# Altium project CAPTIVATE-ISO.PrjPcb
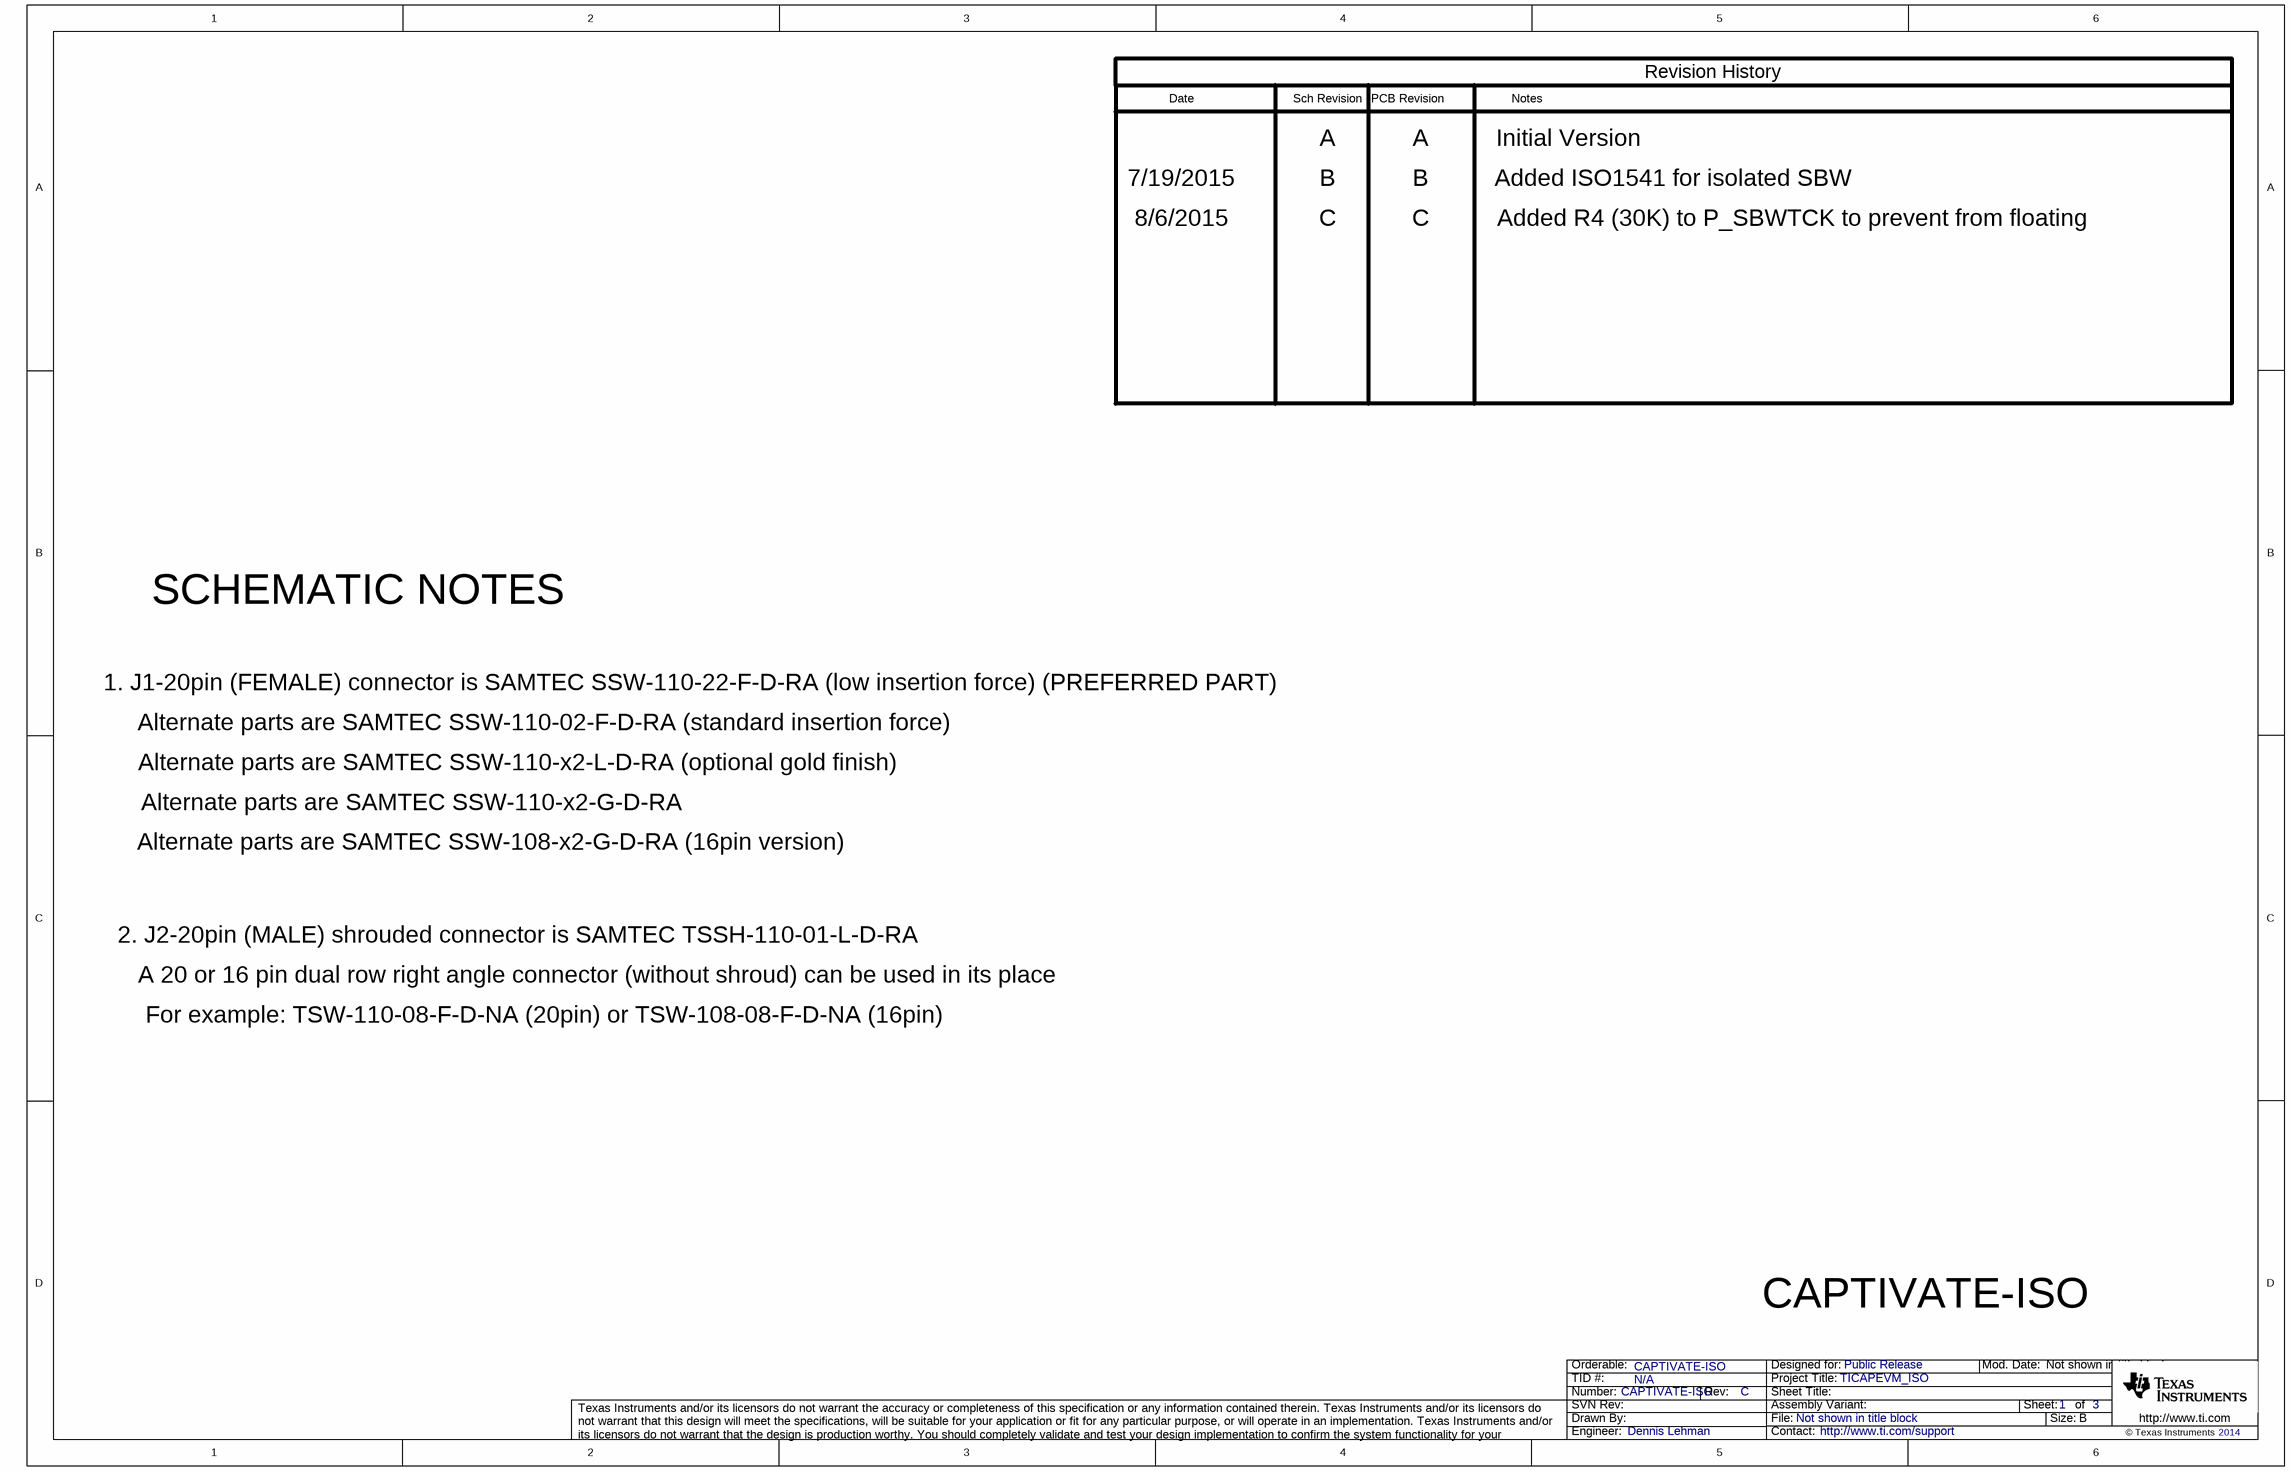
[diagram p0: CoverSheet.SchDoc]
CopyrightYear: 2014; EVM_orderable: CAPTIVATE-ISO; PCB_Layout: Dennis Lehman; PCB_Rev: C; PRJ_Customer: Public Release; PRJ_Engineer: Dennis Lehman; PRJ_Number: CAPTIVATE-ISO; PRJ_Title: TICAPEVM_ISO; SCH_Rev: C; TechSupport: http://www.ti.com/support; TID: N/A
3 sheets, 21 parts. Net scope: global (net labels, ports and power ports of the same name join across sheets).
Board file: captivate_iso.PcbDoc
Sheets:
  CoverSheet.SchDoc
  captivate_iso.SchDoc
  hardware.SchDoc

## Sheet CoverSheet.SchDoc
size 431 x 279 mm; Date: Not shown in title block; ApprovedBy: Not shown in title block; CheckedBy: Not shown in title block; Author: Not shown in title block; CompanyName: Not shown in title block; Engineer: Not shown in title block; Organization: Not shown in title block; Address1: Not shown in title block; Address2: Not shown in title block; Address3: Not shown in title block; Address4: Not shown in title block; DocumentNumber: 1; Revision: Use project parameter SCH_Rev; SheetNumber: 1; SheetTotal: 3; PageSetup: Record=PageOptions|CenterHorizontal=True|CenterVertical=True|PrintScale=1.00|XCorrection=1.00|YCorrection=1.00|PrintKind=0|BorderSize=5000000|LeftOffset=0|BottomOffset=0|Orientation=2|PaperLength=1000|PaperWidth=1000|Scale=100|PaperSource=15|PrintQuality=600|MediaType=1|DitherType=10|PaperKind=Letter|PrintScaleMode=1; CurrentTime: Not shown in title block; CurrentDate: Not shown in title block; Time: Not shown in title block; DocumentFullPathAndName: Not shown in title block; DocumentName: Not shown in title block; ModifiedDate: Not shown in title block; ImagePath: Not shown in title block

### Notes on the sheet
- Date
- Sch Revision
- PCB Revision
- Notes
- Revision History
- A
- Initial Version
- 7/19/2015
- 8/6/2015
- B
- C
- Added ISO1541 for isolated SBW
- Added R4 (30K) to P_SBWTCK to prevent from floating
- SCHEMATIC NOTES
- 1. J1-20pin (FEMALE) connector is SAMTEC SSW-110-22-F-D-RA (low insertion force) (PREFERRED PART)
- Alternate parts are SAMTEC SSW-110-x2-L-D-RA (optional gold finish)
- Alternate parts are SAMTEC SSW-110-02-F-D-RA (standard insertion force)
- Alternate parts are SAMTEC SSW-110-x2-G-D-RA
- Alternate parts are SAMTEC SSW-108-x2-G-D-RA (16pin version)
- 2. J2-20pin (MALE) shrouded connector is SAMTEC TSSH-110-01-L-D-RA
- For example: TSW-110-08-F-D-NA (20pin) or TSW-108-08-F-D-NA (16pin)
- A 20 or 16 pin dual row right angle connector (without shroud) can be used in its place
- CAPTIVATE-ISO
- Drawn By:
- SVN Rev:
- Number:
- TID #:
- Orderable:
- Rev:
- Sheet Title:
- File:
- Project Title:
- Designed for:
- Assembly Variant:
- Mod. Date:
- Sheet:
- Size:
- of
- http://www.ti.com
- Texas Instruments and/or its licensors do not warrant the accuracy or completeness of this specification or any information contained therein. Texas Instruments and/or its licensors do not warrant that this design will meet the specifications, will be suitable for your application or fit for any particular purpose, or will operate in an implementation. Texas Instruments and/or its licensors do not warrant that the design is production worthy. You should completely validate and test your design implementation to confirm the system functionality for your application.
- Engineer:
- Contact:
- © Texas Instruments

## Sheet captivate_iso.SchDoc
size 431 x 279 mm; Date: Not shown in title block; ApprovedBy: Not shown in title block; CheckedBy: Not shown in title block; Author: Not shown in title block; CompanyName: Not shown in title block; Engineer: Not shown in title block; Organization: Not shown in title block; Address1: Not shown in title block; Address2: Not shown in title block; Address3: Not shown in title block; Address4: Not shown in title block; DocumentNumber: 1; Revision: Use project parameter SCH_Rev; SheetNumber: 2; SheetTotal: 3; PageSetup: Record=PageOptions|CenterHorizontal=True|CenterVertical=True|PrintScale=1.00|XCorrection=1.00|YCorrection=1.00|PrintKind=0|BorderSize=5000000|LeftOffset=0|BottomOffset=0|Orientation=2|PaperLength=1000|PaperWidth=1000|Scale=100|PaperSource=15|PrintQuality=600|MediaType=1|DitherType=10|PaperKind=Letter|PrintScaleMode=1; CurrentTime: Not shown in title block; CurrentDate: Not shown in title block; Time: Not shown in title block; DocumentFullPathAndName: Not shown in title block; DocumentName: Not shown in title block; ModifiedDate: Not shown in title block; ImagePath: Not shown in title block
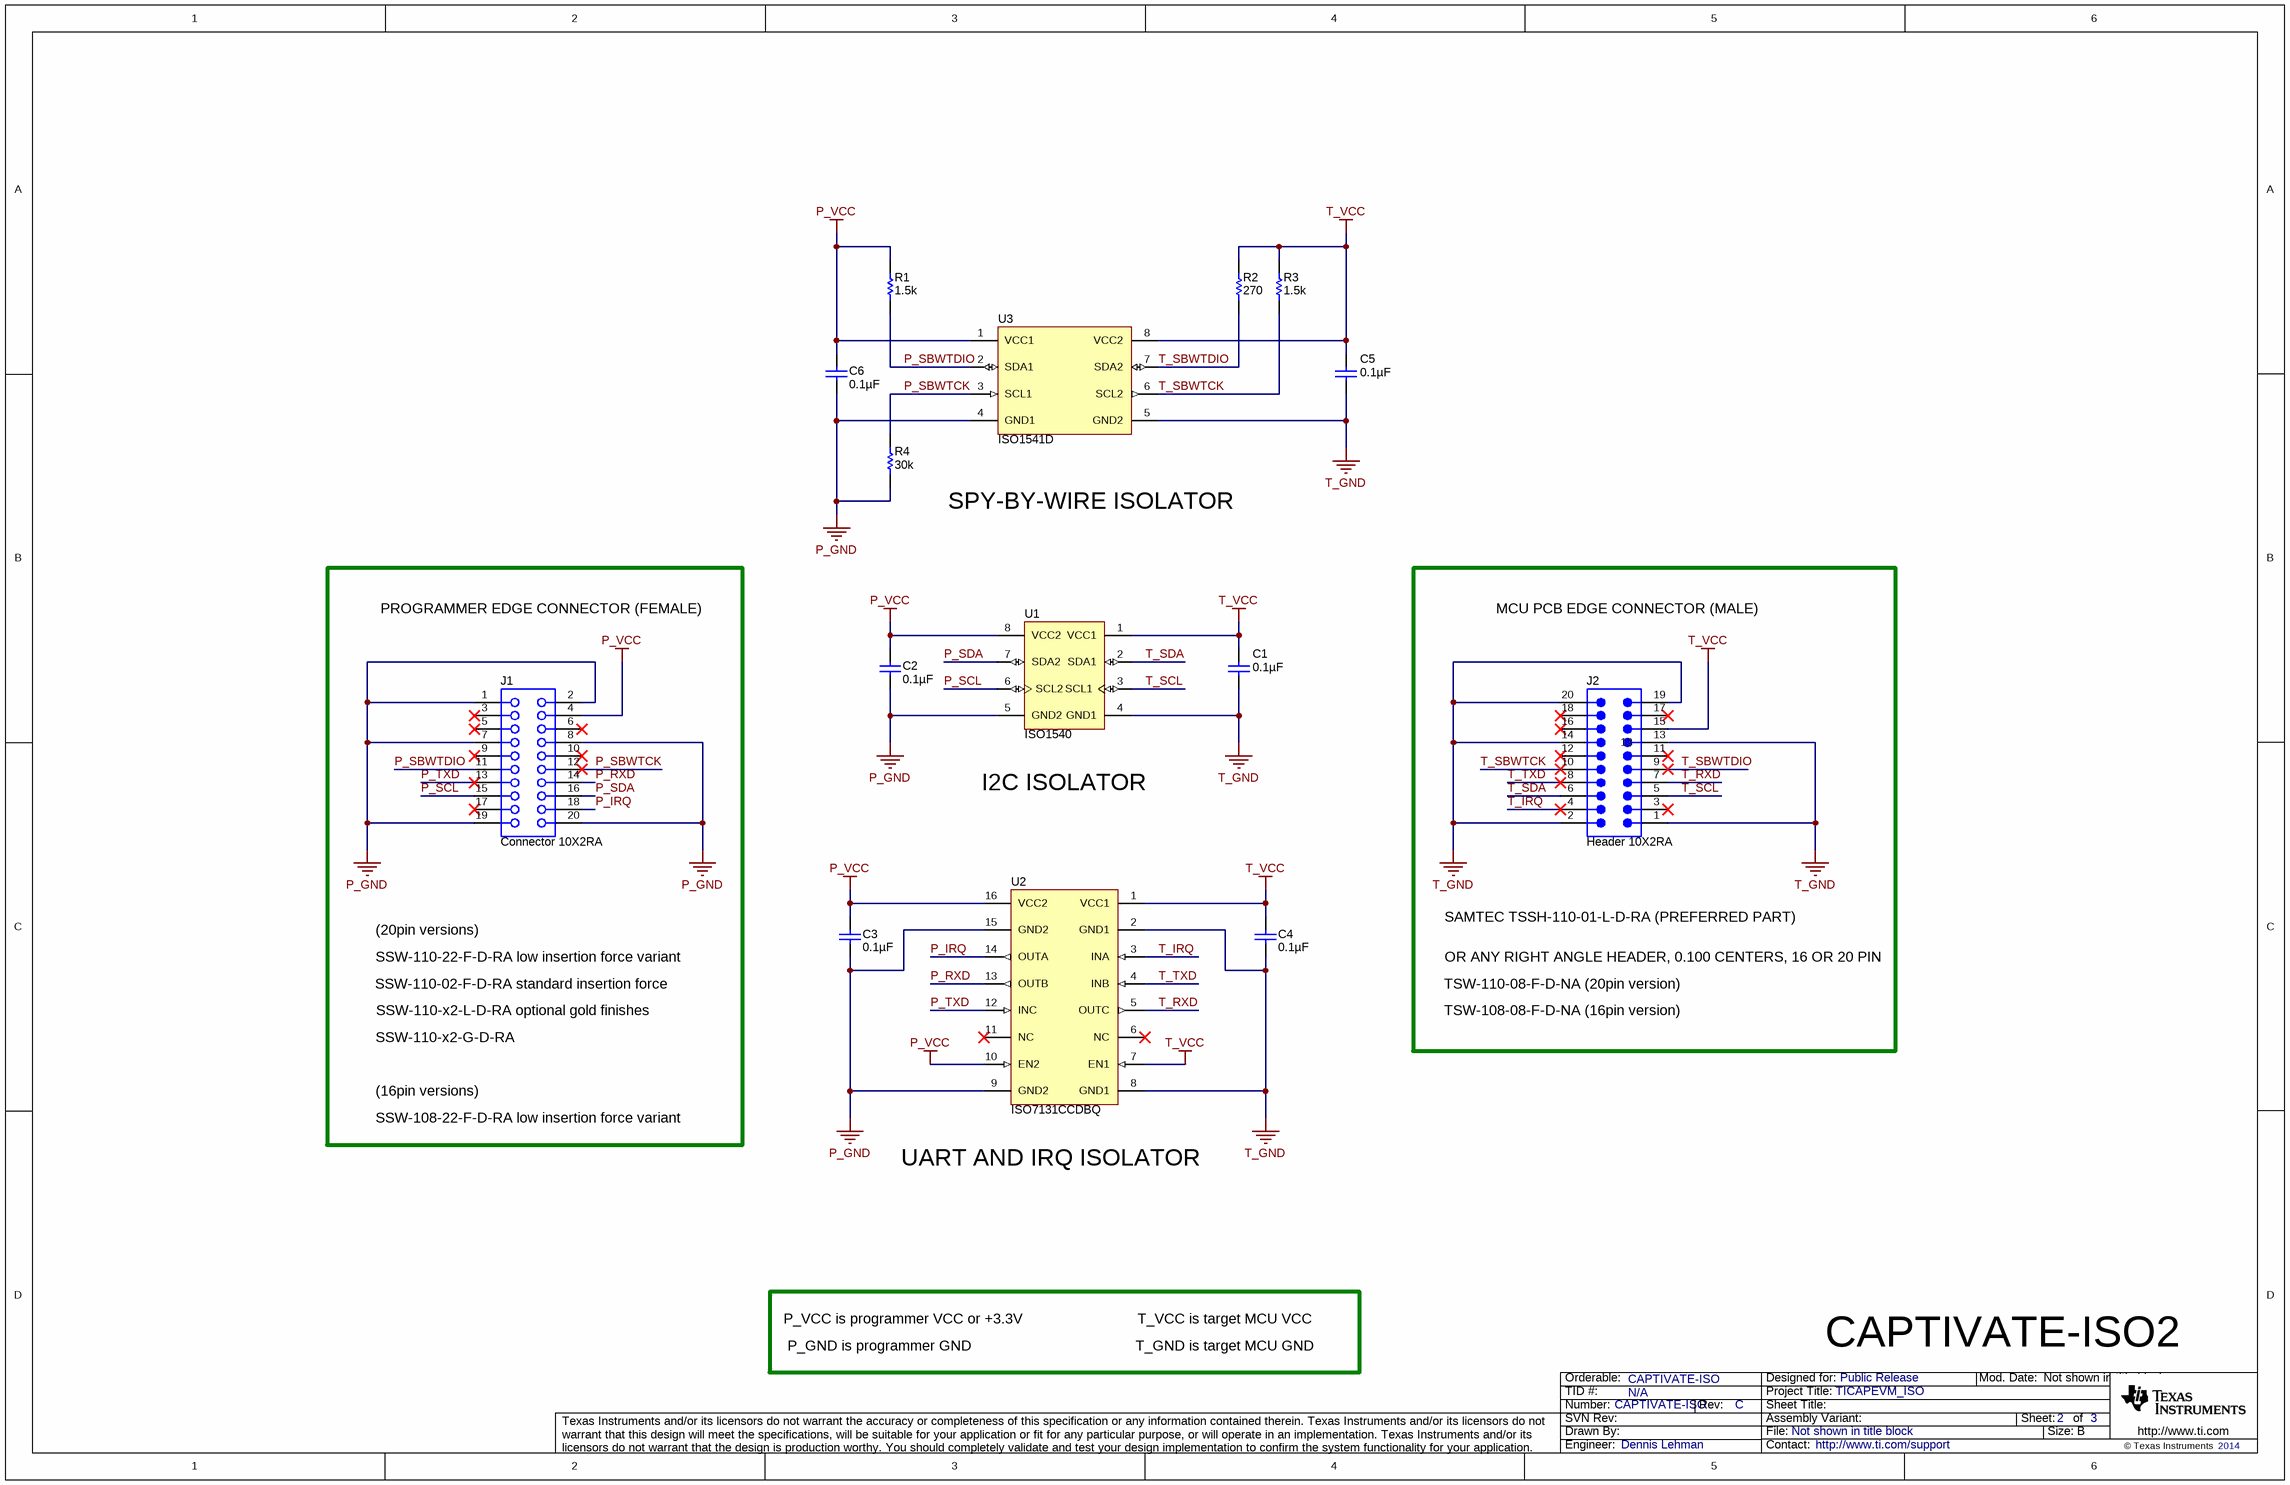
[diagram p1: captivate_iso.SchDoc]

### Parts
C1  ValueDisplayed: 0.1µF  [0402]  (hidden comment: C1005X5R1A104K)
C2  ValueDisplayed: 0.1µF  [0402]  (hidden comment: C1005X5R1A104K)
C3  ValueDisplayed: 0.1µF  [0402]  (hidden comment: C1005X5R1A104K)
C4  ValueDisplayed: 0.1µF  [0402]  (hidden comment: C1005X5R1A104K)
C5  ValueDisplayed: 0.1µF  [0402]  (hidden comment: C1005X5R1A104K)
C6  ValueDisplayed: 0.1µF  [0402]  (hidden comment: C1005X5R1A104K)
J1  Connector 10X2RA  [CONN2X10RA]
J2  Header 10X2RA  [HDR2X10RA]
R1  ValueDisplayed: 1.5k  [0402]  (hidden comment: CRCW04021K50JNED)
R2  ValueDisplayed: 270  [0402]  (hidden comment: CRCW0402270RJNED)
R3  ValueDisplayed: 1.5k  [0402]  (hidden comment: CRCW04021K50JNED)
R4  ValueDisplayed: 30k  [0402]  (hidden comment: CRCW040230K0JNED)
U1  ISO1540  [D0008A_L]
U2  ISO7131CCDBQ  [DBQ0016A_N]
U3  ISO1541D  [D0008A_N]

### Nets
P_GND: C2.1 C3.1 C6.1 J1.1 J1.2 J1.7 J1.8 J1.19 J1.20 R4.1 U1.5(GND2) U2.9(GND2) U2.15(GND2) U3.4(GND1)
P_VCC: C2.2 C3.2 C6.2 J1.4 R1.2 U1.8(VCC2) U2.10(EN2) U2.16(VCC2) U3.1(VCC1)
T_GND: C1.2 C4.1 C5.2 J2.1 J2.2 J2.13 J2.14 J2.19 J2.20 U1.4(GND1) U2.2(GND1) U2.8(GND1) U3.5(GND2)
T_VCC: C1.1 C4.2 C5.1 J2.15 R2.2 R3.2 U1.1(VCC1) U2.1(VCC1) U2.7(EN1) U3.8(VCC2)
P_IRQ: J1.18 U2.14(OUTA)
P_RXD: J1.14 U2.13(OUTB)
P_SBWTCK: J1.12 R4.2 U3.3(SCL1)
P_SBWTDIO: J1.11 R1.1 U3.2(SDA1)
P_SCL: J1.15 U1.6(SCL2)
P_SDA: J1.16 U1.7(SDA2)
P_TXD: J1.13 U2.12(INC)
T_IRQ: J2.4 U2.3(INA)
T_RXD: J2.7 U2.5(OUTC)
T_SBWTCK: J2.10 R3.1 U3.6(SCL2)
T_SBWTDIO: J2.9 R2.1 U3.7(SDA2)
T_SCL: J2.5 U1.3(SCL1)
T_SDA: J2.6 U1.2(SDA1)
T_TXD: J2.8 U2.4(INB)

Not connected (* = marked no-connect by the designer): J1 3* 5* 6* 9* 10* 17*; J2 3* 11* 12* 16* 17* 18*; U2 6(NC)* 11(NC)*

### Notes on the sheet
- SPY-BY-WIRE ISOLATOR
- PROGRAMMER EDGE CONNECTOR (FEMALE)
- MCU PCB EDGE CONNECTOR (MALE)
- I2C ISOLATOR
- (20pin versions)
- SSW-110-22-F-D-RA low insertion force variant
- SAMTEC TSSH-110-01-L-D-RA (PREFERRED PART)
- OR ANY RIGHT ANGLE HEADER, 0.100 CENTERS, 16 OR 20 PIN
- SSW-110-x2-G-D-RA
- SSW-110-x2-L-D-RA optional gold finishes
- SSW-110-02-F-D-RA standard insertion force
- TSW-110-08-F-D-NA (20pin version)
- TSW-108-08-F-D-NA (16pin version)
- (16pin versions)
- SSW-108-22-F-D-RA low insertion force variant
- UART AND IRQ ISOLATOR
- P_GND is programmer GND
- P_VCC is programmer VCC or +3.3V
- T_VCC is target MCU VCC
- T_GND is target MCU GND
- CAPTIVATE-ISO2
- Drawn By:
- SVN Rev:
- Number:
- TID #:
- Orderable:
- Rev:
- Sheet Title:
- File:
- Project Title:
- Designed for:
- Assembly Variant:
- Mod. Date:
- Sheet:
- Size:
- of
- B
- http://www.ti.com
- Texas Instruments and/or its licensors do not warrant the accuracy or completeness of this specification or any information contained therein. Texas Instruments and/or its licensors do not warrant that this design will meet the specifications, will be suitable for your application or fit for any particular purpose, or will operate in an implementation. Texas Instruments and/or its licensors do not warrant that the design is production worthy. You should completely validate and test your design implementation to confirm the system functionality for your application.
- Engineer:
- Contact:
- © Texas Instruments

### Library data of the parts
C1-C6 = C1005X5R1A104K: CAP, CERM, 0.1 µF, 10 V, +/- 10%, X5R, 0402; Manufacturer: TDK; Polarized: N; CompType: Capacitor; Value: 0.1uF; U/M: EA; Cap_F: 0.0000001; Tolerance_%: 10; ESR_ohm: 0.0186; Value1: 0.0186 ohm; Value2: 10V; TaMin_C: -55; TaMax_C: 85; SymbolVersion: 2008-07-09; PartNumber: C1005X5R1A104K; PackageReference: 0402; RoHS: Y; VDC_V: 10; MountType: SMT; Technology: Ceramic; TempCo: X5R; Cap_Case: 0402; Published: 2008-06-19; Publisher: Texas Instruments; LatestRevisionDate: 2014-12-10; ComponentLink1Description: Datasheet link; ComponentLink1URL: http://www.tdk.co.jp/tefe02/e412_c.pdf; Supplier 1: Digi-Key; Supplier Part Number 1: 445-1265-1-ND; Supplier 2: Farnell; Supplier Part Number 2: 1844111
J1 = Connector 10X2RA: Connector, Female, 10-Pin, 2 row, Right Angle; Manufacturer: Samtec; PartNumber: SSW-110-22-F-D-RA; Alternate PartNumber: SSW-110-02-F-D-RA; LatestRevisionDate: 17-Jul-2002; LatestRevisionNote: Re-released for DXP Platform.; Publisher: Altium Limited
J2 = Header 10X2RA: Header, Male, 10-Pin, 2 row, Shround, Right Angle; Manufacturer: Samtec; PartNumber: TSSH-110-01-L-D-RA; LatestRevisionDate: 17-Jul-2002; LatestRevisionNote: Re-released for DXP Platform.; Publisher: Altium Limited; Supplier: Samtec
R1 R3 = CRCW04021K50JNED: RES, 1.5 k, 5%, 0.063 W, 0402; Manufacturer: Vishay-Dale; CompType: Resistor; Value: 1.5k; Res_ohm: 1500; Value_Code: 1k50; Tolerance_%: 5; Power_W: 0.063; Value2: 0.063W; VDC_V: 50; TempCo: 200 ppm/C; EIA_Code: E24; U/M: EA; SymbolVersion: 2009-05-29; PartNumber: CRCW04021K50JNED; PackageReference: 0402; RoHS: Y; Value1: 5%; MountType: SMT; Technology: Thick Film; Published: 2008-06-26; Publisher: Texas Instruments; LatestRevisionDate: 2015-05-08; ComponentLink1Description: Datasheet link; ComponentLink1URL: http://www.vishay.com/docs/20035/dcrcwe3.pdf; Supplier 1: Digi-Key; Supplier Part Number 1: 541-1.5KJCT-ND; Supplier 2: Mouser; Supplier Part Number 2: 71-CRCW0402J-1.5K-E3; Supplier 3: Farnell; Supplier Part Number 3: 1558782
R2 = CRCW0402270RJNED: RES, 270, 5%, 0.063 W, 0402; Manufacturer: Vishay-Dale; CompType: Resistor; Value: 270; Value_Code: 270R; Tolerance_%: 5; Power_W: 0.063; Value2: 0.063W; VDC_V: 50; TempCo: 200 ppm/C; EIA_Code: E24; U/M: EA; SymbolVersion: 2009-05-29; PartNumber: CRCW0402270RJNED; PackageReference: 0402; RoHS: Y; Res_ohm: 270; Value1: 5%; MountType: SMT; Technology: Thick Film; Published: 2008-06-26; Publisher: Texas Instruments; LatestRevisionDate: 2015-05-08; ComponentLink1Description: Datasheet link; ComponentLink1URL: http://www.vishay.com/docs/20035/dcrcwe3.pdf; Supplier 1: Digi-Key; Supplier Part Number 1: 541-270JCT-ND; Supplier 2: Mouser; Supplier Part Number 2: 71-CRCW0402J-270-E3; Supplier 3: Farnell; Supplier Part Number 3: 1514691
R4 = CRCW040230K0JNED: RES, 30 k, 5%, 0.063 W, 0402; Manufacturer: Vishay-Dale; CompType: Resistor; Value: 30k; Res_ohm: 30000; Value_Code: 30k0; Tolerance_%: 5; Power_W: 0.063; Value2: 0.063W; VDC_V: 50; TempCo: 200 ppm/C; EIA_Code: E24; U/M: EA; SymbolVersion: 2009-05-29; PartNumber: CRCW040230K0JNED; PackageReference: 0402; RoHS: Y; Value1: 5%; MountType: SMT; Technology: Thick Film; Published: 2008-06-26; Publisher: Texas Instruments; LatestRevisionDate: 2015-05-08; ComponentLink1Description: Datasheet link; ComponentLink1URL: http://www.vishay.com/docs/20035/dcrcwe3.pdf; Supplier 1: Digi-Key; Supplier Part Number 1: 541-30KJCT-ND; Supplier 2: Mouser; Supplier Part Number 2: 71-CRCW0402J-30K-E3; Supplier 3: Farnell; Supplier Part Number 3: 1514695
U1 = ISO1540: I2C Bidirectional Isolator, 2 Channel Width, 3.0 to 12.0 V, -40 to 85 degC, 8-pin SOIC (D), Green (RoHS & no Sb/Br); Manufacturer: Texas Instruments; Alternate Manufacturer: None; Alternate PartNumber: Equivalent; VCC(Max)(V): 12; VCC(Min)(V): 3; Max Frequency(kHz): 400; Channel Width: 2; 5V Tolerant I/O: Yes; DatasheetVersion: SCPS145A; PackageVersion: revM, Jun-2011; PackageReference: D0008A; PackageDescription: 8-Pin Plastic Small Outline Integrated Circuit, 4.9 x 3.9 mm, Pitch 1.27 mm Pitch; Supplier 1: Digi-Key; Supplier Part Number 1: 296-34896-5-ND; Eco-Plan: Green (RoHS & no Sb/Br); SubFamily: I2C Bidirectional Isolator; Vcc range(V): 3.0 to 12.0; Master Side I2C Bus Capacitance Supported(pF): 400; Slave Side I2C Bus Capacitance Supported(pF): 400; Open Drain I/O Type: Yes; MountType: SMT; PartNumber: ISO1540; Code_JEDEC: MS-012AA; ComponentLink1Description: Datasheet; ComponentLink1URL: http://www.ti.com/general/docs/lit/getliterature.tsp?genericPartNumber=P82B715&fileType=pdf; ComponentLink2Description: URL Link1; ComponentLink2URL: SamplesURL:http://www.ti.com/product/iso1540#samples
U2 = ISO7131CCDBQ: 4242-VPK Small-Footprint and Low-Power Triple Channels Digital Isolators, DBQ0016A; Manufacturer: Texas Instruments; SymbolCreator: a0799628; CompType: IC; U/M: EA; PackageReference: DBQ0016A; MountType: SMT; PartNumber: ISO7131CCDBQ; ComponentLink1Description: Datasheet Link; ComponentLink1URL: http://www.ti.com/lit/ds/symlink/iso7141cc.pdf; Alternate Manufacturer: Texas Instruments; SymbolVersion: 2013-09-25; RoHS: Y; Publisher: Texas Instruments; LatestRevisionDate: 2014-12-10; Supplier 1: Digikey; Supplier Part Number 1: 296-40134-2-ND
U3 = ISO1541D: Low-Power Bidirectional I2C Isolators, D0008A; Manufacturer: Texas Instruments; SymbolCreator: a0411947; CompType: IC; U/M: EA; SymbolVersion: 2013-04-30; PartNumber: ISO1541D; PackageReference: D0008A; MountType: SMT; ComponentLink1Description: Datasheet Link; ComponentLink1URL: http://www.ti.com/lit/ds/symlink/iso1541.pdf; RoHS: Y; Publisher: Texas Instruments; LatestRevisionDate: 2015-05-12; Alternate Manufacturer: Texas Instruments; Supplier 1: Digikey; Supplier Part Number 1: 296-34872-2-ND

## Sheet hardware.SchDoc
size 431 x 279 mm; Date: Not shown in title block; ApprovedBy: Not shown in title block; CheckedBy: Not shown in title block; Author: Not shown in title block; CompanyName: Not shown in title block; Engineer: Not shown in title block; Organization: Not shown in title block; Address1: Not shown in title block; Address2: Not shown in title block; Address3: Not shown in title block; Address4: Not shown in title block; DocumentNumber: 3; Revision: Use project parameter SCH_Rev; SheetNumber: 3; SheetTotal: 3; PageSetup: Record=PageOptions|CenterHorizontal=True|CenterVertical=True|PrintScale=1.00|XCorrection=1.00|YCorrection=1.00|PrintKind=0|BorderSize=5000000|LeftOffset=0|BottomOffset=0|Orientation=2|PaperLength=1000|PaperWidth=1000|Scale=100|PaperSource=15|PrintQuality=600|MediaType=1|DitherType=10|PaperKind=Letter|PrintScaleMode=1; CurrentTime: Not shown in title block; CurrentDate: Not shown in title block; Time: Not shown in title block; DocumentFullPathAndName: Not shown in title block; DocumentName: Not shown in title block; ModifiedDate: Not shown in title block; ImagePath: Not shown in title block
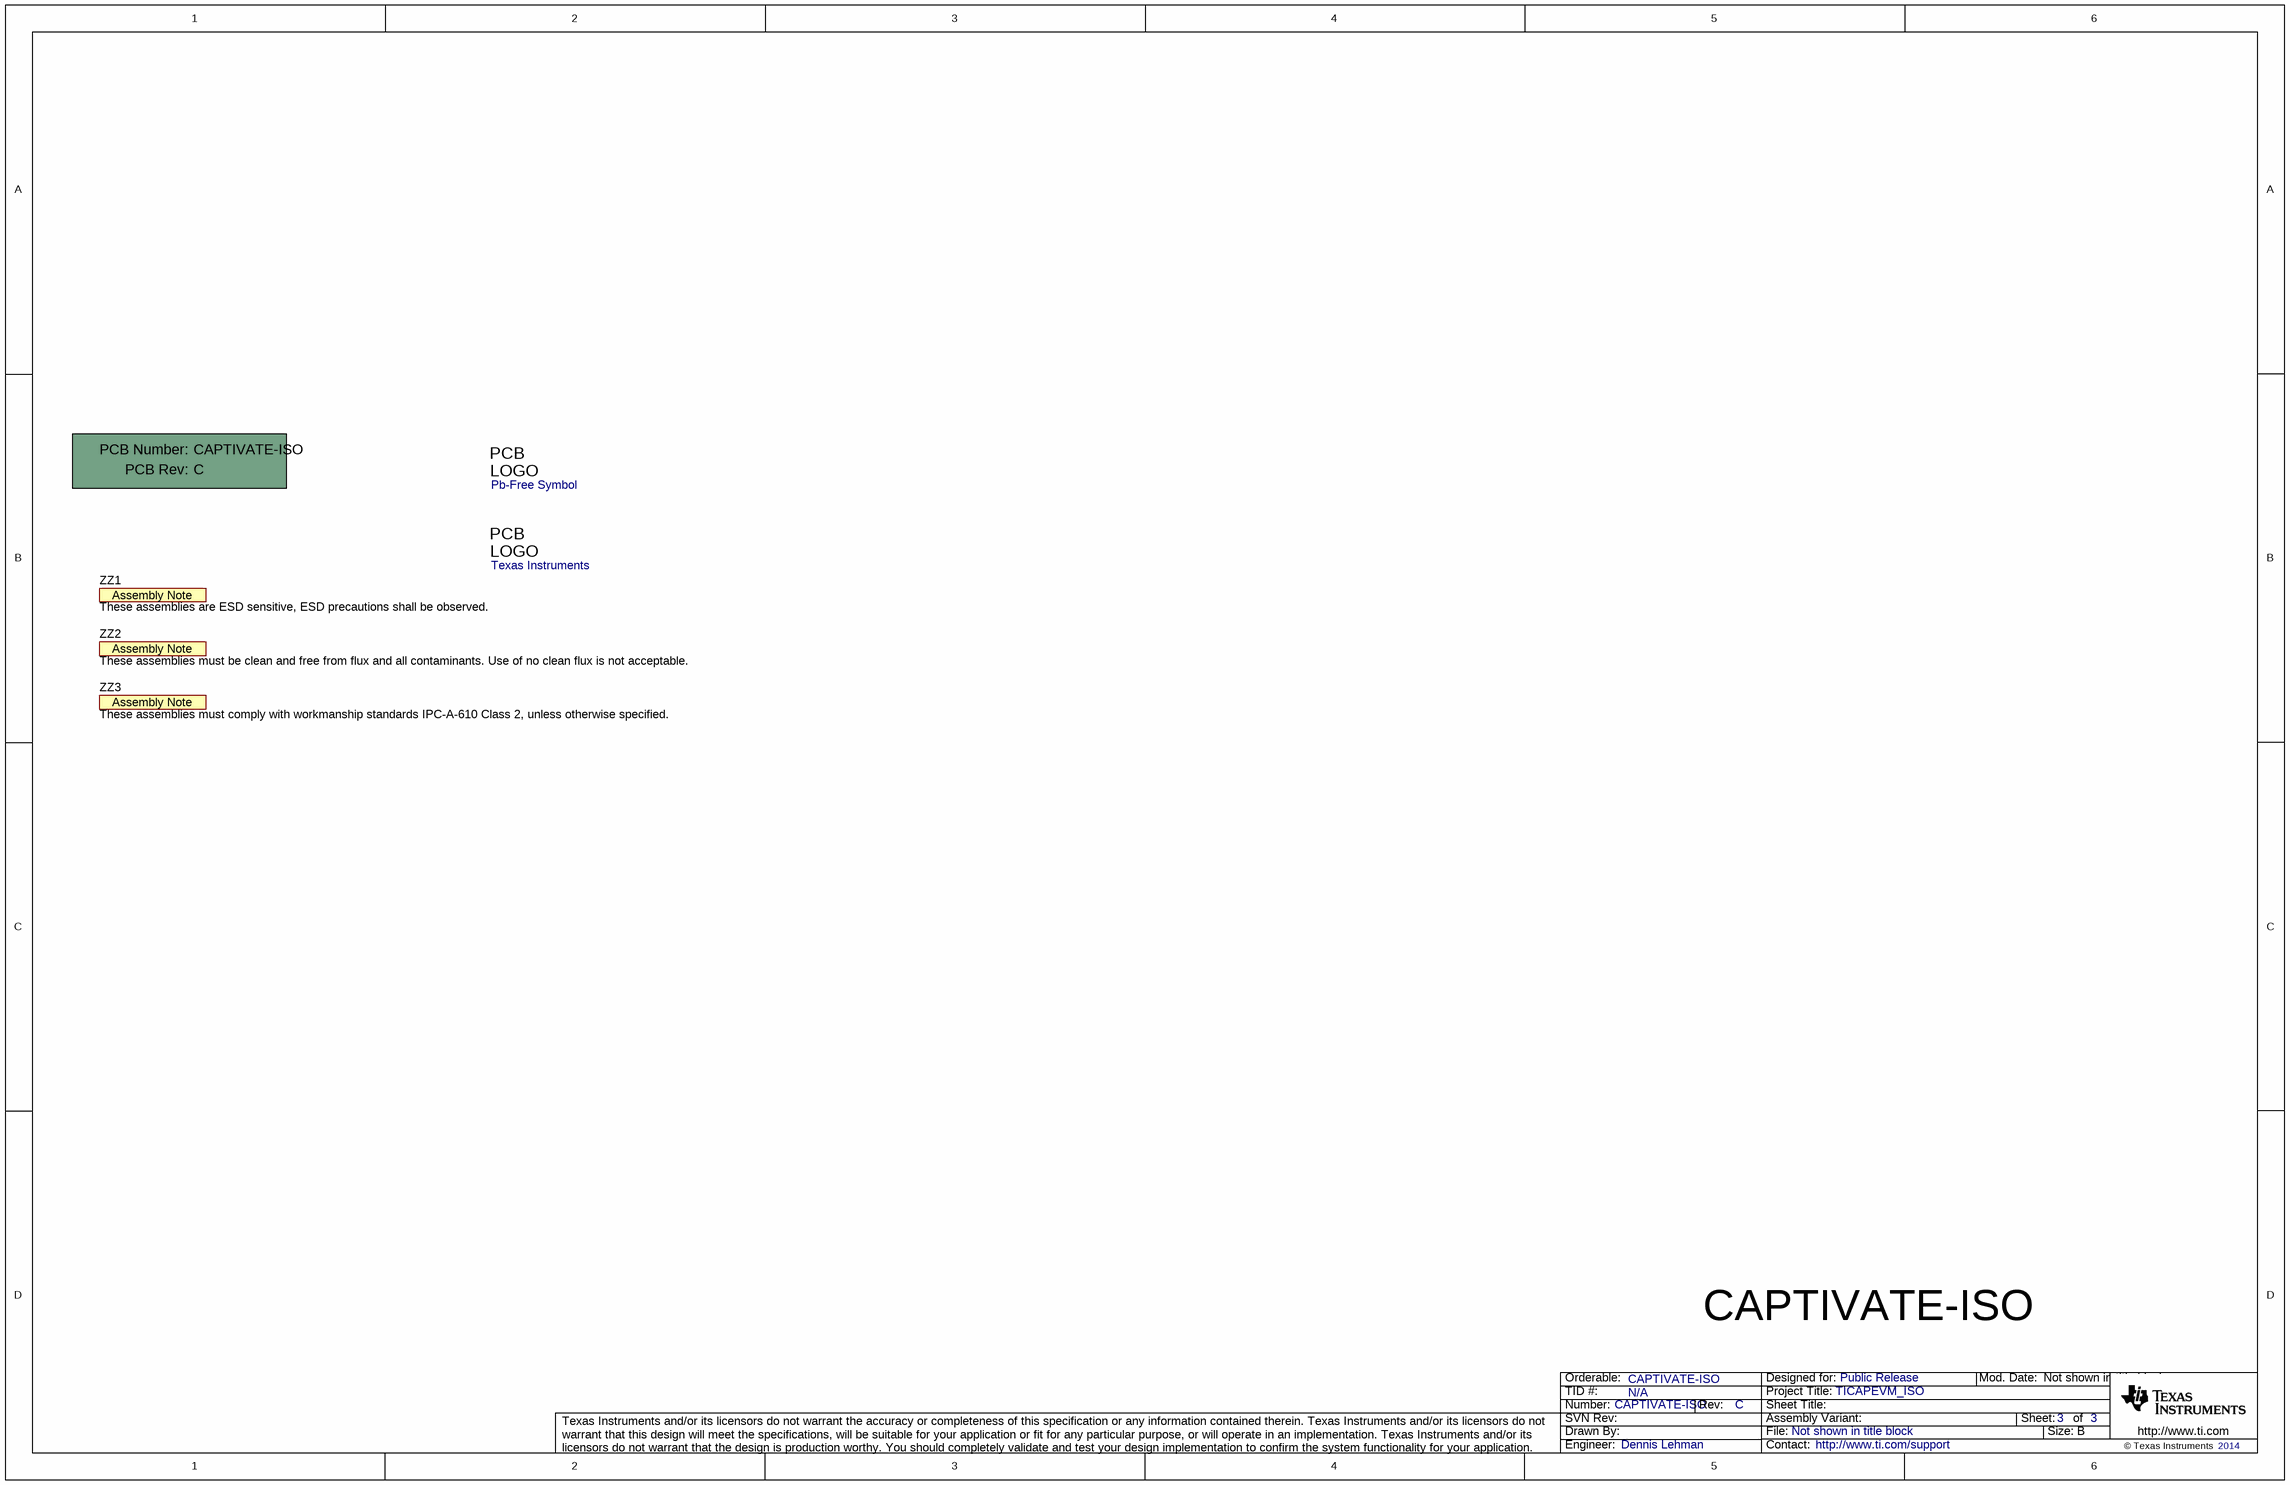
[diagram p2: hardware.SchDoc]

### Parts
!PCB1  Printed Circuit Board  (value not drawn)  (mechanical)
Logo2  Pb-Free Symbol  [Pb-Free_Overlay_Small]  (no BOM)
Logo3  Texas Instruments  [TI_Symbol_Overlay_Small]  (no BOM)
ZZ1  These assemblies are ESD sensitive, ESD precautions shall be observed.  [AssemblyNote]  (no BOM)
ZZ2  These assemblies must be clean and free from flux and all contaminants. Use of no clean flux is not acceptable.  [AssemblyNote]  (no BOM)
ZZ3  These assemblies must comply with workmanship standards IPC-A-610 Class 2, unless otherwise specified.  [AssemblyNote]  (no BOM)

### Notes on the sheet
- CAPTIVATE-ISO
- Drawn By:
- SVN Rev:
- Number:
- TID #:
- Orderable:
- Rev:
- Sheet Title:
- File:
- Project Title:
- Designed for:
- Assembly Variant:
- Mod. Date:
- Sheet:
- Size:
- of
- B
- http://www.ti.com
- Texas Instruments and/or its licensors do not warrant the accuracy or completeness of this specification or any information contained therein. Texas Instruments and/or its licensors do not warrant that this design will meet the specifications, will be suitable for your application or fit for any particular purpose, or will operate in an implementation. Texas Instruments and/or its licensors do not warrant that the design is production worthy. You should completely validate and test your design implementation to confirm the system functionality for your application.
- Engineer:
- Contact:
- © Texas Instruments
- (in symbol AssemblyNote) Assembly Note
- (in symbol Pb-Free) PCB; LOGO
- (in symbol PCB) PCB Number:; PCB Rev:
- (in symbol TI_Logo) PCB; LOGO

### Library data of the parts
!PCB1 = PCB: Manufacturer: Any; PartNumber: CAPTIVATE-ISO; SymbolCreator: a0412235; SymbolVersion: 2012-05-30; CompType: PCB; RoHS: O; MountType: N/A; Publisher: Texas Instruments; LatestRevisionDate: 2014-11-19
Logo2 = Pb-Free: SymbolCreator: a0412235; SymbolVersion: 2011-08-22; Published: 2009-03-03; Publisher: Texas Instruments; LatestRevisionDate: 2014-11-20
Logo3 = TI_Logo: Texas Instrument Corporate Signature; SymbolCreator: a0412235; SymbolVersion: 2011-08-22; ClassName: Logo; Published: 2009-03-03; Publisher: Texas Instruments; LatestRevisionDate: 2014-11-20
ZZ1-ZZ3 = AssemblyNote: SymbolCreator: codlsc; SymbolVersion: 2010-05-18; CompType: AssemblyNote; ClassName: AssemblyNote; Publisher: Texas Instruments; LatestRevisionDate: 2012-06-14; LatestRevisionNote: Initial Version; Alternate Manufacturer: -; Alternate PartNumber: -